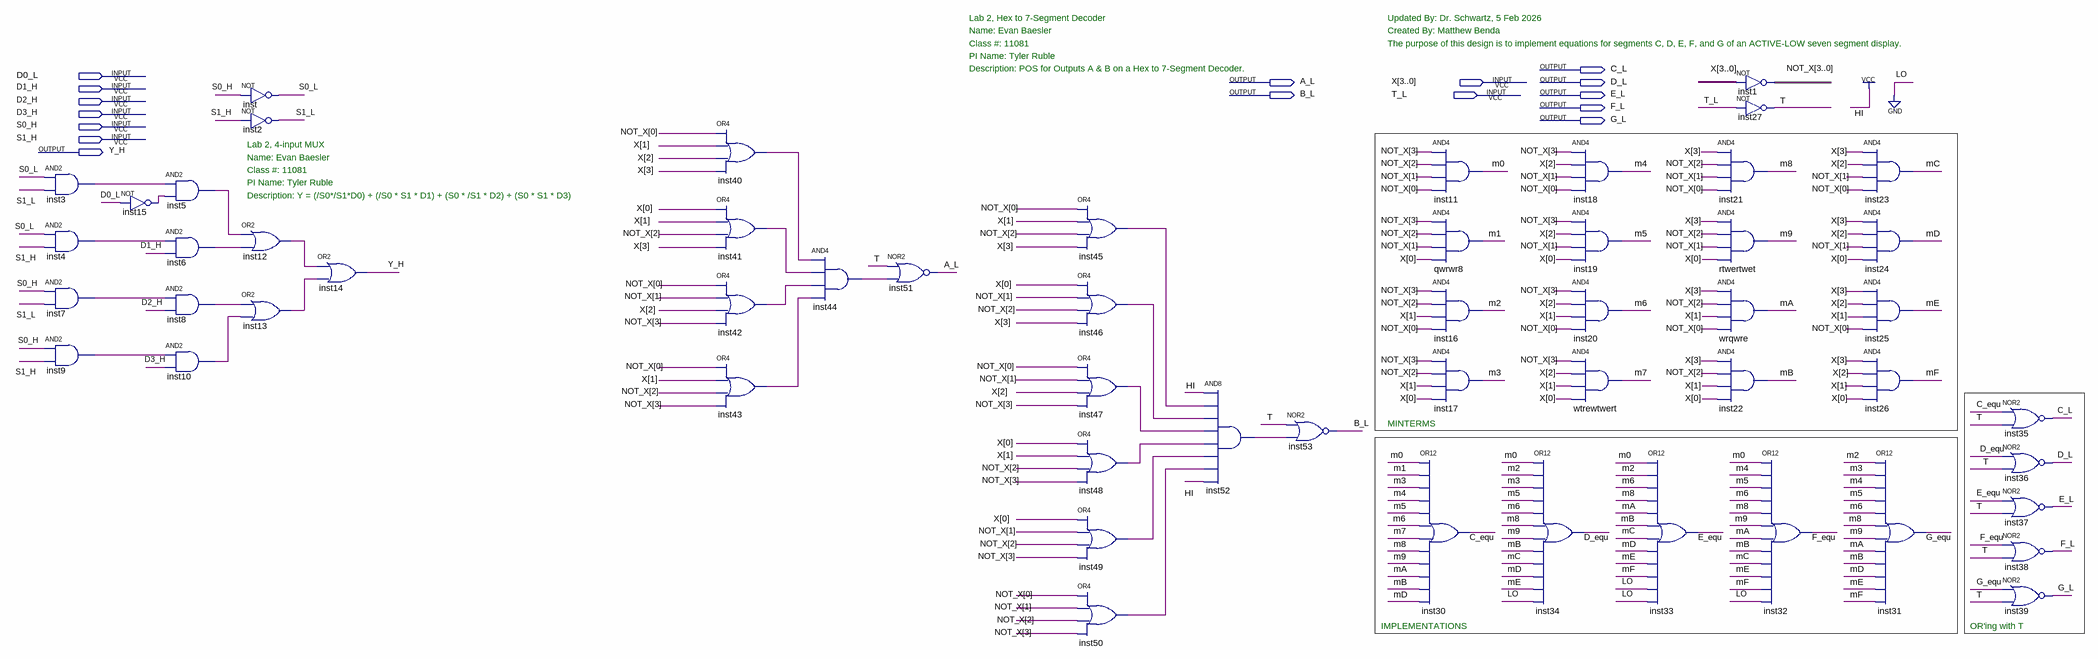
[diagram p0: schematic sheet]
// Quartus schematic lab2_combined.bdf as structural Verilog: 56 symbols, 16 pins
module lab2_combined (
  input  D0_L,
  input  [3:0] X,
  input  D1_H,
  input  T_L,
  input  D2_H,
  input  D3_H,
  input  S0_H,
  input  S1_H,
  output C_L,
  output A_L,
  output D_L,
  output B_L,
  output E_L,
  output F_L,
  output G_L,
  output Y_H
);

  wire C_equ, D_equ, E_equ, F_equ, G_equ, inst3_out, inst4_out, inst5_out, inst6_out, inst7_out, inst8_out,
       inst9_out, inst10_out, inst12_out, inst13_out, inst15_out, inst40_out, inst41_out, inst42_out,
       inst43_out, inst44_out, inst45_out, inst46_out, inst47_out, inst48_out, inst49_out, inst50_out,
       inst52_out, m0, m1, m2, m3, m4, m5, m6, m7, m8, m9, mA, mB, mC, mD, mE, mF, S0_L, S1_L, T;
  wire [3:0] NOT_X;

  and inst3 (inst3_out, S0_L, S1_L);
  and inst4 (inst4_out, S0_L, S1_H);
  and inst7 (inst7_out, S0_H, S1_L);
  and inst9 (inst9_out, S0_H, S1_H);
  not inst15 (inst15_out, D0_L);
  and inst5 (inst5_out, inst3_out, inst15_out);
  and inst6 (inst6_out, inst4_out, D1_H);
  and inst8 (inst8_out, inst7_out, D2_H);
  and inst10 (inst10_out, inst9_out, D3_H);
  not inst (S0_L, S0_H);
  not inst2 (S1_L, S1_H);
  or inst12 (inst12_out, inst5_out, inst6_out);
  or inst13 (inst13_out, inst8_out, inst10_out);
  or inst14 (Y_H, inst12_out, inst13_out);
  or inst40 (inst40_out, NOT_X[0], X[1], X[2], X[3]);
  or inst41 (inst41_out, X[0], X[1], NOT_X[2], X[3]);
  or inst42 (inst42_out, NOT_X[0], NOT_X[1], X[2], NOT_X[3]);
  or inst43 (inst43_out, NOT_X[0], X[1], NOT_X[2], NOT_X[3]);
  and inst44 (inst44_out, inst40_out, inst41_out, inst42_out, inst43_out);
  nor inst51 (A_L, T, inst44_out);
  or inst45 (inst45_out, NOT_X[0], X[1], NOT_X[2], X[3]);
  or inst46 (inst46_out, X[0], NOT_X[1], NOT_X[2], X[3]);
  or inst47 (inst47_out, NOT_X[0], NOT_X[1], X[2], NOT_X[3]);
  or inst48 (inst48_out, X[0], X[1], NOT_X[2], NOT_X[3]);
  or inst49 (inst49_out, X[0], NOT_X[1], NOT_X[2], NOT_X[3]);
  or inst50 (inst50_out, NOT_X[0], NOT_X[1], NOT_X[2], NOT_X[3]);
  and inst52 (inst52_out, 1'b1, inst45_out, inst46_out, inst47_out, inst48_out, inst49_out, inst50_out, 1'b1);
  nor inst53 (B_L, T, inst52_out);
  and inst11 (m0, NOT_X[3], NOT_X[2], NOT_X[1], NOT_X[0]);
  and qwrwr8 (m1, NOT_X[3], NOT_X[2], NOT_X[1], X[0]);
  and inst16 (m2, NOT_X[3], NOT_X[2], X[1], NOT_X[0]);
  and inst17 (m3, NOT_X[3], NOT_X[2], X[1], X[0]);
  or inst30 (C_equ, m0, m1, m3, m4, m5, m6, m7, m8, m9, mA, mB, mD);
  or inst34 (D_equ, m0, m2, m3, m5, m6, m8, m9, mB, mC, mD, mE, 1'b0);
  and inst18 (m4, NOT_X[3], X[2], NOT_X[1], NOT_X[0]);
  and inst19 (m5, NOT_X[3], X[2], NOT_X[1], X[0]);
  and inst20 (m6, NOT_X[3], X[2], X[1], NOT_X[0]);
  and wtrewtwert (m7, NOT_X[3], X[2], X[1], X[0]);
  or inst33 (E_equ, m0, m2, m6, m8, mA, mB, mC, mD, mE, mF, 1'b0, 1'b0);
  assign NOT_X = ~X;  // NOT inst1, 4 bits wide
  not inst27 (T, T_L);
  and inst21 (m8, X[3], NOT_X[2], NOT_X[1], NOT_X[0]);
  and rtwertwet (m9, X[3], NOT_X[2], NOT_X[1], X[0]);
  and wrqwre (mA, X[3], NOT_X[2], X[1], NOT_X[0]);
  and inst22 (mB, X[3], NOT_X[2], X[1], X[0]);
  or inst32 (F_equ, m0, m4, m5, m6, m8, m9, mA, mB, mC, mE, mF, 1'b0);
  and inst23 (mC, X[3], X[2], NOT_X[1], NOT_X[0]);
  and inst24 (mD, X[3], X[2], NOT_X[1], X[0]);
  and inst25 (mE, X[3], X[2], X[1], NOT_X[0]);
  and inst26 (mF, X[3], X[2], X[1], X[0]);
  or inst31 (G_equ, m2, m3, m4, m5, m6, m8, m9, mA, mB, mD, mE, mF);
  nor inst35 (C_L, C_equ, T);
  nor inst36 (D_L, D_equ, T);
  nor inst37 (E_L, E_equ, T);
  nor inst38 (F_L, F_equ, T);
  nor inst39 (G_L, G_equ, T);

  // Notes on the sheet:
  //   Lab 2, Hex to 7-Segment Decoder
  //   Updated By: Dr. Schwartz, 5 Feb 2026
  //   Name: Evan Baesler
  //   Created By: Matthew Benda
  //   Class #: 11081
  //   The purpose of this design is to implement equations for segments C, D, E, F, and G of an ACTIVE-LOW seven segment display.            
  //   PI Name: Tyler Ruble
  //   Description: POS for Outputs A & B on a Hex to 7-Segment Decoder.
  //   Lab 2, 4-input MUX
  //   Name: Evan Baesler
  //   Class #: 11081
  //   PI Name: Tyler Ruble
  //   Description: Y = (/S0*/S1*D0) + (/S0 * S1 * D1) + (S0 * /S1 * D2) + (S0 * S1 * D3)
  //   MINTERMS
  //   IMPLEMENTATIONS
  //   OR'ing with T
endmodule
